# Altium schematic sheet Sensor Schematic.SchDoc: Sensor Processing
size A4; Date: 06/08/2023; DrawnBy: Viktor Neshikj; Revision: 1.0
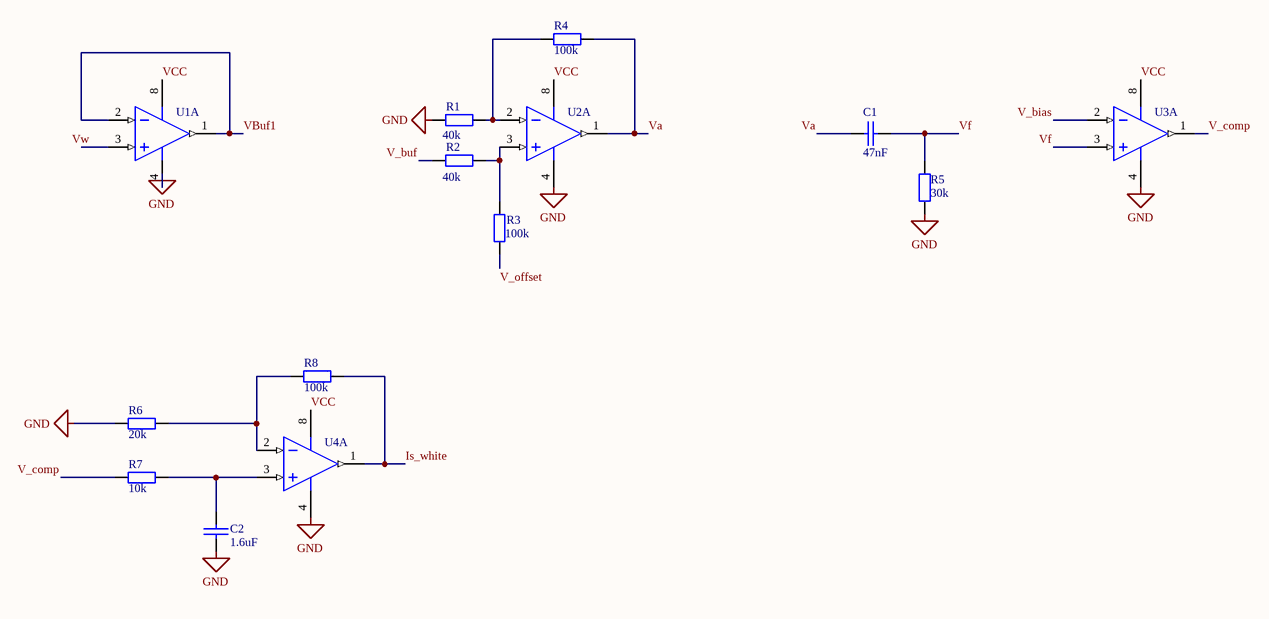
[diagram p0: Sensor Schematic.SchDoc]

## Parts
C1  47nF  [0805 CAP]
C2  1.6uF  [0805 CAP]
R1  40k  [0805 RES]
R2  40k  [0805 RES]
R3  100k  [0805 RES]
R4  100k  [0805 RES]
R5  30k  [0805 RES]
R6  20k  [0805 RES]
R7  10k  [0805 RES]
R8  100k  [0805 RES]
U1  (no value)  [SO - 8]  (part A of 2)
U2  (no value)  [SO - 8]  (part A of 2)
U3  (no value)  [SO - 8]  (part A of 2)
U4  (no value)  [SO - 8]  (part A of 2)

## Nets
GND: C2.1 R1.1 R5.1 R6.2 U1.4(VSS) U2.4(VSS) U3.4(VSS) U4.4(VSS)
Is_white: R8.1 U4.1(VOUTA)
V_bias: U3.2(VINA-)
V_buf: R2.1
V_comp: R7.2 U3.1(VOUTA)
V_offset: R3.1
Va: C1.1 R4.1 U2.1(VOUTA)
VBuf1: U1.1(VOUTA) U1.2(VINA-)
VCC: U1.8(VDD) U2.8(VDD) U3.8(VDD) U4.8(VDD)
Vf: C1.2 R5.2 U3.3(VINA+)
Vw: U1.3(VINA+)
NetC2_2: C2.2 R7.1 U4.3(VINA+)
NetR1_2: R1.2 R4.2 U2.2(VINA-)
NetR2_2: R2.2 R3.2 U2.3(VINA+)
NetR6_1: R6.1 R8.2 U4.2(VINA-)

## Library data of the parts
C1 C2 = CerCap_SMT_0805: SMT ceramic capacitor 0805 size; Value: *
R1-R8 = Res_SMT_0805: 0805 resistor; Published: 8-Jun-2000; LatestRevisionDate: 17-Jul-2002; LatestRevisionNote: Re-released for DXP Platform.; PackageReference: AXIAL-0.4; Publisher: Altium Limited; Value: *; ComponentLink1Description: https://nz.mouser.com/datasheet/2/315/AOA0000C304-1149620.pdf
U1-U4 = TLC082_SMT_SOIC8: IC OPAMP GP 10MHZ 8SOIC; Manufacturer: Texas Instruments; Manufacturer Part Number: TLC082CDR; Amplifier Type: General Purpose; Slew Rate: 19 V/µs; Current - Supply: 1.9mA; Voltage - Supply, Single/Dual (±): 4.5 V ~ 16 V, ±2.25 V ~ 8 V; Supplier 1: Digi-Key; RoHS: RoHS Compliant; Category: Integrated Circuits (ICs); Stock 1: 29765; Pricing 1: 1=3.44, 10=3.087, 100=2.4808, 500=2.03822, 1000=1.68881 (NZD); Packaging: Cut Tape (CT); Part Status: Active; Output Type: -; Operating Temperature: 0°C ~ 70°C; Mounting Type: Surface Mount; Package / Case: 8-SOIC (0.154", 3.90mm Width); Supplier Device Package: 8-SOIC; Base Part Number: TLC082; ComponentLink1URL: http://www.ti.com/lit/ds/symlink/tlc080a.pdf; ComponentLink1Description: http://www.ti.com/lit/ds/symlink/tlc080a.pdf; Supplier Part Number 1: 296-2421-1-ND